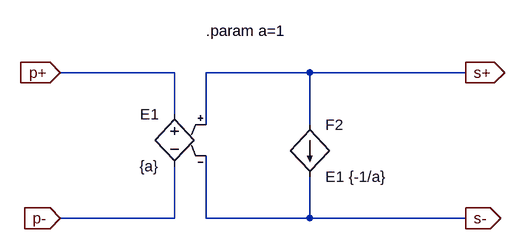
[diagram p0: schematic trafoIdeal.asc]
trafoIdeal.asc, the LTspice schematic file:
Version 4
SHEET 1 880 680
WIRE 48 48 -128 48
WIRE 256 48 96 48
WIRE 496 48 256 48
WIRE 48 112 48 48
WIRE 96 128 96 48
WIRE 256 128 256 48
WIRE 48 272 48 192
WIRE 48 272 -128 272
WIRE 96 272 96 176
WIRE 256 272 256 208
WIRE 256 272 96 272
WIRE 496 272 256 272
FLAG -128 48 p+
IOPIN -128 48 In
FLAG -128 272 p-
IOPIN -128 272 In
FLAG 496 48 s+
IOPIN 496 48 Out
FLAG 496 272 s-
IOPIN 496 272 Out
SYMBOL e 48 96 M0
SYMATTR InstName E1
SYMATTR Value {a}
SYMBOL f 256 128 R0
SYMATTR InstName F2
SYMATTR Value E1 {-1/a}
TEXT 96 -16 Left 2 !.param a=1

The netlist it stands for:
* trafoIdeal.asc
E1 p+ p- s+ s- {a}
F2 s+ s- E1 {-1/a}
.param a=1
.backanno
.end